# Altium schematic sheet [1] Power Supply.SchDoc
size Letter
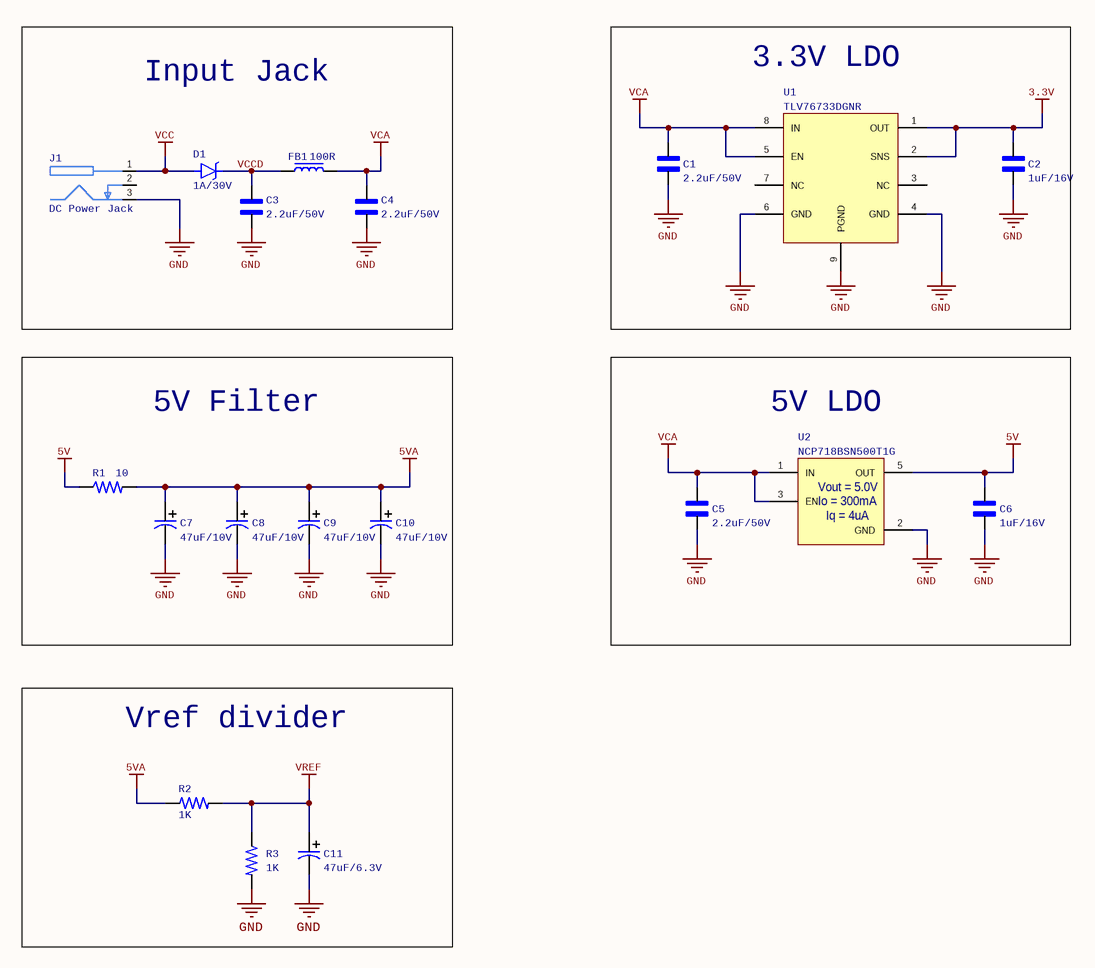
[diagram p0: [1] Power Supply.SchDoc]

## Parts
C1  2.2uF/50V  [C1206]
C2  1uF/16V  [C0603]
C3  2.2uF/50V  [C1206]
C4  2.2uF/50V  [C1206]
C5  2.2uF/50V  [C1206]
C6  1uF/16V  [C0603]
C7  47uF/10V  [EIA1210]
C8  47uF/10V  [EIA1210]
C9  47uF/10V  [EIA1210]
C10  47uF/10V  [EIA1210]
C11  47uF/6.3V  [EIA1206]
D1  1A/30V  [SOD-323]
FB1  100R  [FB_0603]
J1  DC Power Jack  [DC Power Jack 2.1mm x 5.5mm]
R1  10  [R0603]
R2  1K  [R0603]
R3  1K  [R0603]
U1  TLV76733DGNR  [HVSSOP-8]
U2  NCP718BSN500T1G  [SOT23-5]

## Blocks framed on the sheet
Input Jack: C3 C4 D1 FB1 J1
3.3V LDO: C1 C2 U1
5V Filter: C7-C10 R1
5V LDO: C5 C6 U2
Vref divider: C11 R2 R3

## Nets
3.3V: C2.1 U1.1(OUT) U1.2(SNS)
5V: C6.1 R1.1 U2.5(OUT)
5VA: C7.1 C8.1 C9.1 C10.1 R1.2 R2.1
GND: C1.2 C2.2 C3.2 C4.2 C5.2 C6.2 C7.2 C8.2 C9.2 C10.2 C11.2 J1.3 R3.2 U1.4(GND) U1.6(GND) U1.9(PGND) U2.2(GND)
VCA: C1.1 C4.1 C5.1 FB1.2 U1.5(EN) U1.8(IN) U2.1(IN) U2.3(EN)
VCC: D1.A J1.1
VREF: C11.1 R2.2 R3.1
VCCD: C3.1 D1.C FB1.1

Not connected (* = marked no-connect by the designer): J1 2; U1 3(NC) 7(NC)

## Notes on the sheet
- (in symbol NCP718BSN500T1G) Vout = 5.0V; Io = 300mA; Iq = 4uA

## Library data of the parts
C1 C3-C5 = C1206 2.2uF/50V: MLCC 2.2uF 50V X7R 10% 1206; Manufacturer: KEMET; Manufacturer Part Number: C1206C225J5RECAUTO; Supplier 1: Mouser; Supplier Part Number 1: 80-C1206C225J5RECAUT; RoHS: Yes; Stock 1: 1416; Pricing 1: 1=0.26000, 10=0.11800, 50=0.11800, 100=0.10100, 1000=0.10100, 10000=0.10100 (USD)
C2 C6 = C0603 1uF/16V X5R: MLCC 1uF 16V X5R 10% SMD 0603 85C Paper T/R; Manufacturer: Yageo; Manufacturer Part Number: CC0603KRX5R7BB105; Dissipation Factor: 7%; Supplier 1: Mouser; Supplier Part Number 1: 603-CC603KRX5R7BB105; RoHS: Yes; Category: Ceramic Capacitors; Stock 1: 726921; Pricing 1: 1=0.17000, 10=0.09100, 50=0.09100, 100=0.04100, 1000=0.03400, 10000=0.02100 (USD); Mount: Surface Mount; Case/Package: 0603; Number of Pins: 2; Case Code (Imperial): 0603; Case Code (Metric): 1608; Min Operating Temperature: -55°C; Max Operating Temperature: 85°C; Capacitance: 1uF; Tolerance: 10%; Dielectric: X5R; Voltage Rating: 16V; Voltage Rating (DC): 16V; Packaging: Tape and Reel; Package Quantity: 4000; Termination: SMD/SMT; Resistor Type: Ceramic; Series: CC; Construction: Flat; Length: 1.6mm; Width: 0.8mm; Height: 0.8mm; Thickness: 0.035inch; Depth: 0.8mm; Radiation Hardening: No; REACH SVHC: Unknown; Lead Free: Lead Free; Halogen Free: Halogen Free; RoHS Compliant: Yes
C7-C10 = TANT 47UF/10V: Tantalum Capacitors - Solid SMD 10V 47uF 10%; Manufacturer: Kyocera AVX; Manufacturer Part Number: TAJB476K010RNJ; ESR (Equivalent Series Resistance): 1R; Leakage Current: 4.7uA; Polarity: Polar; Dissipation Factor: 8%; Supplier 1: Mouser; RoHS: Yes; Category: Tantalum Capacitors; Stock 1: 71514; Pricing 1: 1=0.46, 10=0.234, 50=0.234, 100=0.201, 1000=0.127, 10000=0.103 (USD); Mount: Surface Mount,PCB; Case/Package: 1210; Case Code (Metric): 3528; Case Code (Imperial): 1411; Dielectric Material: Tantalum; Min Operating Temperature: -55°C; Max Operating Temperature: 125°C; Capacitance: 47uF; Tolerance: 10%; Voltage Rating: 10V; Package Quantity: 2000; Packaging: Tape and Reel; Voltage Rating (DC): 10V; Termination: SMD/SMT; Voltage: 10V; Features: General Purpose; Series: TAJ; Length: 3.5mm; Width: 2.8mm; Height: 1.9mm; Depth: 2.8mm; Radiation Hardening: No; Lead Free: Lead Free; RoHS Compliant: Yes; Reach SVHC Compliant: No; Supplier Part Number 1: 581-TAJB476K010; Number of Pins: 2; Construction: Flat; Lead Pitch: 1.4mm
C11 = TANT 47UF/6.3V: Tantalum Capacitors - Solid SMD 6.3V 47uF 10%; Manufacturer: Kyocera AVX; Manufacturer Part Number: TAJA476K006SNJV; Supplier 1: Mouser; Supplier Part Number 1: 581-TAJA476K006SNJV; RoHS: Yes; Category: Tantalum Capacitors; Stock 1: 97469; Pricing 1: 1=0,57000, 10=0,39900, 50=0,39900, 100=0,20200, 1000=0,15200, 10000=0,12500 (USD); Case/Package: Radial; Voltage Rating (DC): 6.3V; Capacitance: 47uF; Tolerance: 10%; Lead Free: Lead Free; RoHS Compliant: Yes
D1 = Schottky BAT760Q-7: 30V 1A SOD323 DIODE SCHOTTKY; Manufacturer: Diodes; Supplier 1: Mouser; Supplier Part Number 1: 621-BAT760Q-7; Manufacturer Part Number: BAT760Q-7; RoHS: Yes; Category: Rectifier Diodes; Stock 1: 1305; Pricing 1: 1=0.41000, 10=0.27600, 50=0.27600, 100=0.14400, 1000=0.10000, 10000=0.07700 (USD); Mount: Surface Mount; Packaging: Tape and Reel; Average Rectified Current: 1A; Max Reverse Voltage (DC): 30V; RoHS Compliant: Yes
FB1 = FB_0603: Ferrite Bead SMD 0603
J1 = DC Power Jack 2.1mm x 5.5mm: DC Power Connectors Power Jack/Connector 2.1mm x 5.5mm; Manufacturer: Gravitech; Manufacturer Part Number: CON-SOCJ-2155; Supplier 1: Mouser; Supplier Part Number 1: 992-CON-SOCJ-2155; RoHS: Yes; Category: Uncategorized; Stock 1: 2595; Pricing 1: 1=1.00000, 5=1.00000 (USD); Color: Black; Connector Type: Power; Contact Gender: Female
R1 = R0603 10: RES 0603 10 OHM 0.5% 1/10W; Manufacturer: Yageo; Manufacturer Part Number: RT0603DRE0710RL; Resistance: 10R; Max Power Dissipation: 100mW; Voltage Rating (DC): 50V; Supplier 1: Mouser; Supplier Part Number 1: 603-RT0603DRE0710RL; RoHS: Yes; Category: Chip SMD Resistors; Case/Package: 0603; Case Code (Metric): 1608; Case Code (Imperial): 0603; Tolerance: 0.5%; Resistor Type: Thin Film; Number of Terminations: 2
R2 R3 = R0603 1K: Res Thick Film 0603 1K Ohm 1% 1/10W ±50ppm/°C Molded SMD Paper T/R; Manufacturer: Yageo; Manufacturer Part Number: RE0603FRE071KL; Resistance: 1kR; Max Power Dissipation: 100mW; Supplier 1: Mouser; Supplier Part Number 1: 603-RE0603FRE071KL; RoHS: Yes; Category: Chip SMD Resistors; Stock 1: 21464; Pricing 1: 1=0.11000, 10=0.03800, 50=0.03800, 100=0.01700, 1000=0.00800, 10000=0.00500 (USD); Case/Package: 0603; Min Operating Temperature: -55°C; Max Operating Temperature: 155°C; Packaging: Tape and Reel; Resistor Type: Thick Film; Number of Terminations: 2; Tolerance: 1%; Temperature Coefficient: 50ppm/°C; Features: Moisture Resistant; Length: 0.063inch; Width: 0.032inch; Height: 0.022inch; RoHS Compliant: Yes; ComponentLink1URL: http://www.yageo.com/NewPortal/yageodocoutput?fileName=/pdf/R-Chip/PYu-RE_105_RoHS_L_4.pdf&src-supplier=Digi-Key; ComponentLink1Description: http://www.yageo.com/NewPortal/yageodocoutput?fileName=/pdf/R-Chip/PYu-RE_105_RoHS_L_4.pdf&src-supplier=Digi-Key
U1 = TLV76733DGNR: Fixed-output, 1-A, 16-V, positive-voltage low-dropout (LDO) linear regulator 8-HVSSOP -40 to 125; Manufacturer: Texas Instruments; Supplier 1: Mouser; Manufacturer Part Number: TLV76733DGNR; RoHS: Yes; Category: Integrated Circuits (ICs); Stock 1: 27181; Pricing 1: 1=0.88, 10=0.784, 50=0.744, 100=0.611, 1000=0.399, 10000=0.33 (USD); Supplier Part Number 1: 595-TLV76733DGNR
U2 = NCP718BSN500T1G: LDO Regulator, 300 mA, Wide Vin, Ultra-Low Iq Fixed 5.0V, Non-Active Discharge, TSOT23-5; Manufacturer: ON Semiconductor; Supplier 1: Mouser; Manufacturer Part Number: NCP718BSN500T1G; RoHS: Yes; Category: Voltage Regulators - Linear; Stock 1: 32274; Pricing 1: 1=0.61, 10=0.534, 50=0.534, 100=0.37, 1000=0.22, 10000=0.182 (USD); RoHS Compliant: Yes; Supplier Part Number 1: 863-NCP718BSN500T1G